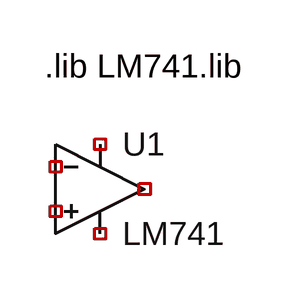
[diagram p0: schematic Draft1.asc]
Draft1.asc, the LTspice schematic file:
Version 4.1
SHEET 1 880 680
SYMBOL OpAmps\\opamp2 288 144 R0
SYMATTR InstName U1
SYMATTR Value LM741
TEXT 248 120 Left 2 !.lib LM741.lib

The netlist it stands for:
* Draft1.asc
X§U1 NC_01 NC_02 NC_03 NC_04 NC_05 LM741  ; pins In+ In- V+ V- OUT
.lib LM741.lib
.backanno
.end